# Altium schematic sheet S2C_IOs3V3.SchDoc
size A4; SheetNumber: 12
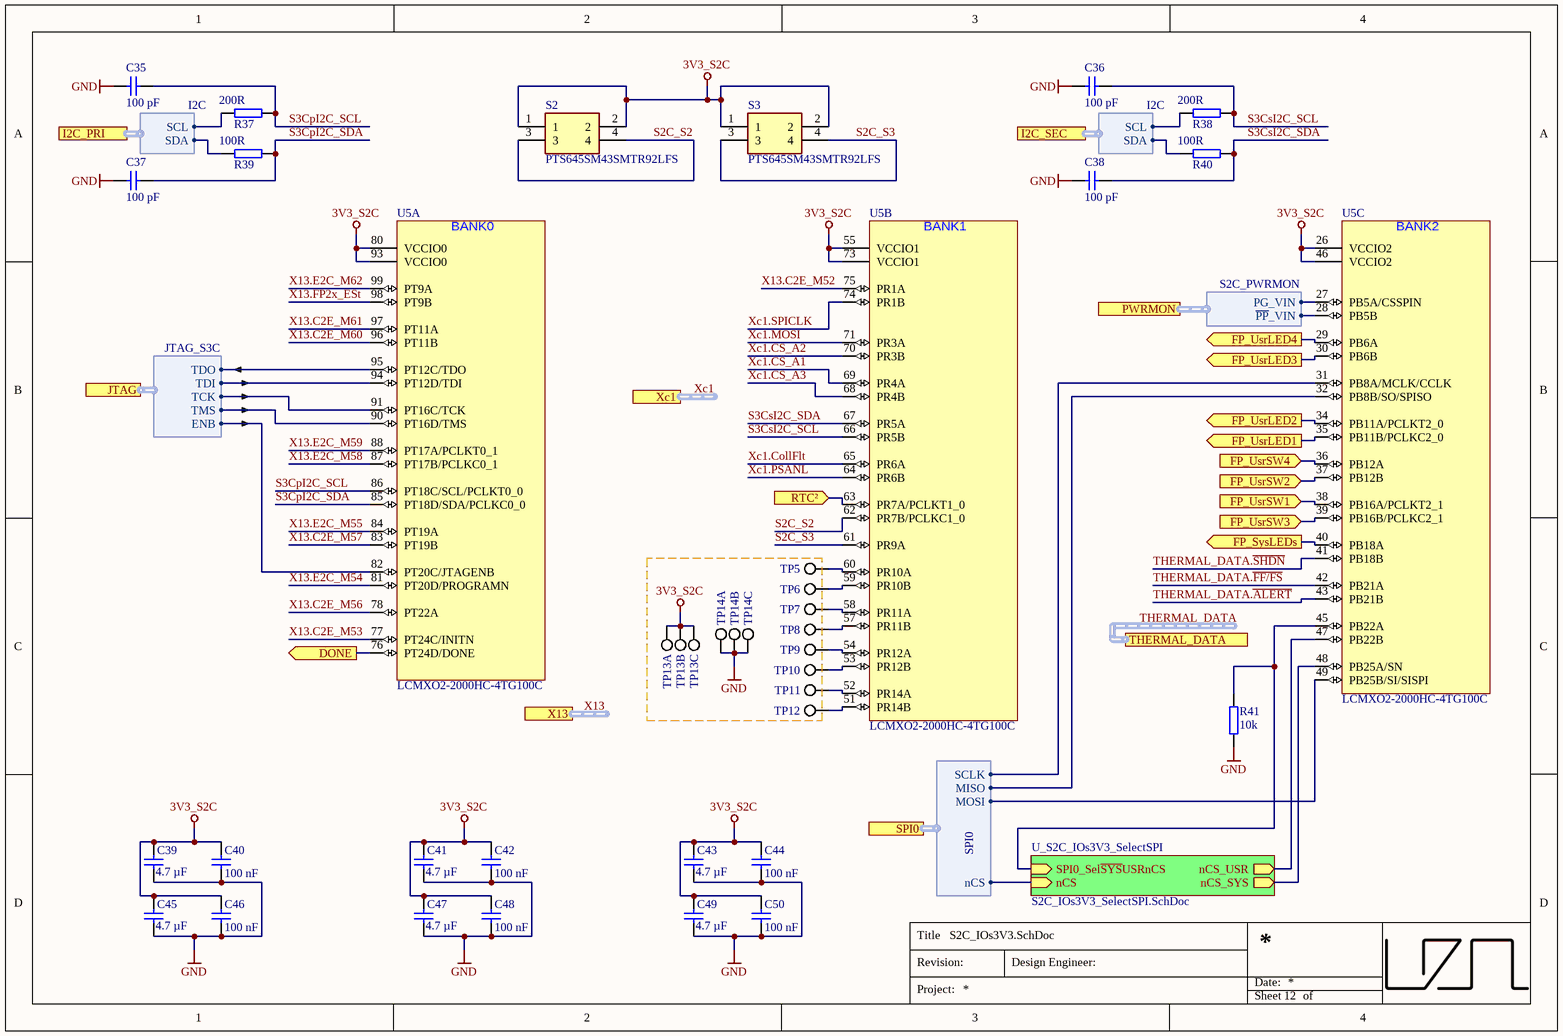
[diagram p0: S2C_IOs3V3.SchDoc]

## Parts
C35  100 pF  [C_0603_TE]
C36  100 pF  [C_0603_TE]
C37  100 pF  [C_0603_TE]
C38  100 pF  [C_0603_TE]
C39  4.7 µF  [C_0603_TE]
C40  100 nF  [C_0603_TE]
C41  4.7 µF  [C_0603_TE]
C42  100 nF  [C_0603_TE]
C43  4.7 µF  [C_0603_TE]
C44  100 nF  [C_0603_TE]
C45  4.7 µF  [C_0603_TE]
C46  100 nF  [C_0603_TE]
C47  4.7 µF  [C_0603_TE]
C48  100 nF  [C_0603_TE]
C49  4.7 µF  [C_0603_TE]
C50  100 nF  [C_0603_TE]
R37  200R  [R_0603_TE]
R38  200R  [R_0603_TE]
R39  100R  [R_0603_TE]
R40  100R  [R_0603_TE]
R41  10k  [R_0603_TE]
S2  PTS645SM43SMTR92LFS  [PTS645_SMT]
S3  PTS645SM43SMTR92LFS  [PTS645_SMT]
TP5  PR10A  [FP-5015-MFG]  (value not drawn)
TP6  PR10B  [FP-5015-MFG]  (value not drawn)
TP7  PR11A  [FP-5015-MFG]  (value not drawn)
TP8  PR11B  [FP-5015-MFG]  (value not drawn)
TP9  PR12A  [FP-5015-MFG]  (value not drawn)
TP10  PR12B  [FP-5015-MFG]  (value not drawn)
TP11  PR14A  [FP-5015-MFG]  (value not drawn)
TP12  PR14B  [FP-5015-MFG]  (value not drawn)
TP13A  3V3_S2C  [FP-5015-MFG]  (value not drawn)
TP13B  3V3_S2C  [FP-5015-MFG]  (value not drawn)
TP13C  3V3_S2C  [FP-5015-MFG]  (value not drawn)
TP14A  GND  [FP-5015-MFG]  (value not drawn)
TP14B  GND  [FP-5015-MFG]  (value not drawn)
TP14C  GND  [FP-5015-MFG]  (value not drawn)
U5  LCMXO2-2000HC-4TG100C  [QFP50P1600X1600X160-100N]  (parts A,B,C of 7)

## Sub-sheets
U_S2C_IOs3V3_SelectSPI = S2C_IOs3V3_SelectSPI.SchDoc: nCS (in), SPI0_Sel~{SYS}USRnCS (in), nCS_USR (out), nCS_SYS (out)

## Ports
DONE (out), FP_SysLEDs (out), FP_UsrLED1 (out), FP_UsrLED2 (out), FP_UsrLED3 (out), FP_UsrLED4 (out), FP_UsrSW1 (in), FP_UsrSW2 (in), FP_UsrSW3 (in), FP_UsrSW4 (in), I2C_PRI (harness I2C), I2C_SEC (harness I2C), JTAG (harness JTAG_S3C), PWRMON (harness S2C_PWRMON), RTC² (in), SPI0 (harness SPI0), THERMAL_DATA (harness T_DATA), X13 (harness X13), Xc1 (harness Xc1)

## Harnesses
JTAG_S3C: TDO, TDI, TCK, TMS, ENB
I2C: SCL, SDA
SPI0: SCLK, MOSI, MISO, nCS
S2C_PWRMON: PG_VIN, ~{PP}_VIN

## Nets
3V3_S2C: C39.1 C40.2 C41.1 C42.2 C43.1 C44.2 C45.1 C46.2 C47.1 C48.2 C49.1 C50.2 S2.1 S2.2 S3.1 S3.2 TP13A.1 TP13B.1 TP13C.1 U5.26(VCCIO2) U5.46(VCCIO2) U5.55(VCCIO1) U5.73(VCCIO1) U5.80(VCCIO0) U5.93(VCCIO0)
GND: C35.2 C36.2 C37.2 C38.2 C39.2 C40.1 C41.2 C42.1 C43.2 C44.1 C45.2 C46.1 C47.2 C48.1 C49.2 C50.1 R41.1 TP14A.1 TP14B.1 TP14C.1
DONE: U5.76(PT24D/DONE) ; port DONE
FP_SysLEDs: U5.40(PB18A) ; port FP_SysLEDs
FP_UsrLED1: U5.35(PB11B/PCLKC2_0) ; port FP_UsrLED1
FP_UsrLED2: U5.34(PB11A/PCLKT2_0) ; port FP_UsrLED2
FP_UsrLED3: U5.30(PB6B) ; port FP_UsrLED3
FP_UsrLED4: U5.29(PB6A) ; port FP_UsrLED4
FP_UsrSW1: U5.38(PB16A/PCLKT2_1) ; port FP_UsrSW1
FP_UsrSW2: U5.37(PB12B) ; port FP_UsrSW2
FP_UsrSW3: U5.39(PB16B/PCLKC2_1) ; port FP_UsrSW3
FP_UsrSW4: U5.36(PB12A) ; port FP_UsrSW4
RTC²: U5.63(PR7A/PCLKT1_0) ; port RTC²
S2C_S2: S2.3 S2.4 U5.62(PR7B/PCLKC1_0)
S2C_S3: S3.3 S3.4 U5.61(PR9A)
S3CpI2C_SCL: C35.1 R37.2 U5.86(PT18C/SCL/PCLKT0_0)
S3CpI2C_SDA: C37.1 R39.2 U5.85(PT18D/SDA/PCLKC0_0)
S3CsI2C_SCL: C36.1 R38.2 U5.66(PR5B)
S3CsI2C_SDA: C38.1 R40.2 U5.67(PR5A)
THERMAL_DATA.~{ALERT}: U5.43(PB21B)
THERMAL_DATA.~{FF/FS}: U5.42(PB21A)
THERMAL_DATA.~{SHDN}: U5.41(PB18B)
X13.C2E_M52: U5.75(PR1A)
X13.C2E_M53: U5.77(PT24C/INITN)
X13.C2E_M56: U5.78(PT22A)
X13.C2E_M57: U5.83(PT19B)
X13.C2E_M60: U5.96(PT11B)
X13.C2E_M61: U5.97(PT11A)
X13.E2C_M54: U5.81(PT20D/PROGRAMN)
X13.E2C_M55: U5.84(PT19A)
X13.E2C_M58: U5.87(PT17B/PCLKC0_1)
X13.E2C_M59: U5.88(PT17A/PCLKT0_1)
X13.E2C_M62: U5.99(PT9A)
X13.FP2x_ESt: U5.98(PT9B)
Xc1.CollFlt: U5.65(PR6A)
Xc1.CS_A1: U5.69(PR4A)
Xc1.CS_A2: U5.70(PR3B)
Xc1.CS_A3: U5.68(PR4B)
Xc1.MOSI: U5.71(PR3A)
Xc1.PSANL: U5.64(PR6B)
Xc1.SPICLK: U5.74(PR1B)
NetR37_1: R37.1 ; port I2C_PRI.SCL
NetR38_1: R38.1 ; port I2C_SEC.SCL
NetR39_1: R39.1 ; port I2C_PRI.SDA
NetR40_1: R40.1 ; port I2C_SEC.SDA
NetR41_2: R41.2 U5.45(PB22A) ; sheet U_S2C_IOs3V3_SelectSPI/SPI0_Sel~{SYS}USRnCS
NetTP5_1: TP5.1 U5.60(PR10A)
NetTP6_1: TP6.1 U5.59(PR10B)
NetTP7_1: TP7.1 U5.58(PR11A)
NetTP8_1: TP8.1 U5.57(PR11B)
NetTP9_1: TP9.1 U5.54(PR12A)
NetTP10_1: TP10.1 U5.53(PR12B)
NetTP11_1: TP11.1 U5.52(PR14A)
NetTP12_1: TP12.1 U5.51(PR14B)
NetU5_27: U5.27(PB5A/CSSPIN) ; port PWRMON.PG_VIN
NetU5_28: U5.28(PB5B) ; port PWRMON.~{PP}_VIN
NetU5_31: U5.31(PB8A/MCLK/CCLK) ; port SPI0.SCLK
NetU5_32: U5.32(PB8B/SO/SPISO) ; port SPI0.MISO
NetU5_47: U5.47(PB22B) ; sheet U_S2C_IOs3V3_SelectSPI/nCS_USR
NetU5_48: U5.48(PB25A/SN) ; sheet U_S2C_IOs3V3_SelectSPI/nCS_SYS
NetU5_49: U5.49(PB25B/SI/SISPI) ; port SPI0.MOSI
NetU5_82: U5.82(PT20C/JTAGENB) ; port JTAG.ENB
NetU5_90: U5.90(PT16D/TMS) ; port JTAG.TMS
NetU5_91: U5.91(PT16C/TCK) ; port JTAG.TCK
NetU5_94: U5.94(PT12D/TDI) ; port JTAG.TDI
NetU5_95: U5.95(PT12C/TDO) ; port JTAG.TDO
(unnamed): sheet U_S2C_IOs3V3_SelectSPI/nCS, port SPI0.nCS

## Buses and harness runs
harness THERMAL_DATA = port THERMAL_DATA
harness X13 = port X13
harness Xc1 = port Xc1

## Notes on the sheet
- Title
- Revision:
- Design Engineer:
- Date:
- Project:
- Sheet
- of
- (in symbol LCMXO2-2000HC-4TG100C, part A) BANK0
- (in symbol LCMXO2-2000HC-4TG100C, part B) BANK1
- (in symbol LCMXO2-2000HC-4TG100C, part C) BANK2

## Library data of the parts
C35-C38 = UZgen_C_0603_100pF_50V_X7R: Generic capacitor; Manufacturer: UZgen; Voltage: 50V; Tolerance: 10 %; Created from: UZgenTool; Manufacturer Part Number: UZgen_C_0603_100pF_50V_X7R; PartID: 4215; Created On: 02/08/2024 11:18:08; Value: 100 pF; Device Package: 0603; Technology: X7R; Mounting Type: SMD; Last Updated: 02/08/2024 11:18:08
C39 C41 C43 C45 C47 C49 = UZgen_C_0603_4.7uF_16V_X5R: Generic capacitor; Manufacturer: UZgen; Voltage: 16V; Tolerance: 10 %; Created from: MGeier; Manufacturer Part Number: UZgen_C_0603_4.7uF_16V_X5R; PartID: 5809; Created On: 20/03/2025 14:43:45; Value: 4.7 µF; Device Package: 0603; Technology: X5R; Mounting Type: SMD; Last Updated: 20/03/2025 14:43:45
C40 C42 C44 C46 C48 C50 = UZgen_C_0603_100nF_50V_X7R: Generic capacitor; Manufacturer: UZgen; Tolerance: 10 %; Voltage: 50 V; Created from: AGeiger; Value: 100 nF; Technology: X7R; Manufacturer Part Number: UZgen_C_0603_100nF_50V_X7R; PartID: 1; Created On: 02/07/2024 14:42:23; Device Package: 0603; Mounting Type: SMD; Last Updated: 02/08/2024 14:45:57
R37 R38 = UZgen_R_0603_200R: Generic resistor; Manufacturer: UZgen; Tolerance: 1 %; Created from: UZgenTool; Manufacturer Part Number: UZgen_R_0603_200R; PartID: 204; Created On: 02/07/2024 17:29:49; Value: 200R; Device Package: 0603; Mounting Type: SMD; Last Updated: 02/07/2024 17:29:49
R39 R40 = UZgen_R_0603_100R: Generic resistor; Manufacturer: UZgen; Tolerance: 1 %; Created from: UZgenTool; Manufacturer Part Number: UZgen_R_0603_100R; PartID: 197; Created On: 02/07/2024 17:29:48; Value: 100R; Device Package: 0603; Mounting Type: SMD; Last Updated: 02/07/2024 17:29:48
R41 = UZgen_R_0603_10k: Generic resistor; Manufacturer: UZgen; Tolerance: 1 %; Created from: AGeiger; Manufacturer Part Number: UZgen_R_0603_10k; PartID: 1; Created On: 02/07/2024 14:34:53; Value: 10k; Device Package: 0603; Mounting Type: SMD; Last Updated: 02/07/2024 14:37:16
S2 S3 = PTS645SM43SMTR92LFS: 50mA SPST 160gf 12V SMD-4P,6x6mm Tactile Switches ROHS; Manufacturer_Name: C & K COMPONENTS; Manufacturer: C&K COMPONENTS; Value: Push Button; Created from: AGeiger; Datasheet Link: https://www.ckswitches.com/media/1471/pts645.pdf; Manufacturer_Part_Number: PTS645SM43SMTR92LFS; Mouser Part Number: 611-PTS645SM43SMTR92; Mouser Price/Stock: https://www.mouser.co.uk/ProductDetail/CK/PTS645SM43SMTR92LFS?qs=FESYatJ8odKPktxv6ncfWg%3D%3D; Arrow Part Number: PTS645SM43SMTR92LFS; Arrow Price/Stock: https://www.arrow.com/en/products/pts645sm43smtr92lfs/ck; Manufacturer Part Number: PTS645SM43SMTR92LFS; PartID: 24; Created On: 31/05/2023 15:31:02; ComponentLink1Description: Datasheet; ComponentLink1URL: https://datasheet.lcsc.com/lcsc/1810121628_C-K-PTS645SM43SMTR92LFS_C221880.pdf; Component Type: Tactile Switch; Device Package: SMD; Last Updated: 31/05/2023 15:31:02; Mounting Type: SMD; Operating Temperature: -20 to +60 °C; Supplier 1: Mouser; Supplier Part Number 1: 611-PTS645SM43SMTR92; Supplier 2: LCSC; Supplier Part Number 2: C221880; Type: Tactile Switch; Live Cycle Status: 1; LCSC Part Number: C221880
TP5-TP12 TP13A TP13B TP13C TP14A TP14B TP14C = 5015: Circuit Board Hardware - PCB SM TEST POINT ON T&R - MINIATURE; Manufacturer Part Number: 5015; Manufacturer: Keystone Electronics; Created from: AGeiger; ComponentLink1Description: Datasheet; ComponentLink2URL: http://www.keyelco.com/product-pdf.cfm?p=1357; ComponentLink1URL: https://www.mouser.de/datasheet/2/215/015-744075.pdf; ComponentLink2Description: Datasheet; PartID: 26; Created On: 03/06/2023 11:19:55; Component Type: Circuit Board Hardware; Device Package: SMD; Last Updated: 03/06/2023 11:43:17; Mounting Type: SMD; Supplier 1: Mouser; Supplier Part Number 1: 534-5015; Type: PCB SMD Testpoint; Live Cycle Status: 1; LCSC Part Number: C5199798
  TP5: Value: PR10A
  TP6: Value: PR10B
  TP7: Value: PR11A
  TP8: Value: PR11B
  TP9: Value: PR12A
  TP10: Value: PR12B
  TP11: Value: PR14A
  TP12: Value: PR14B
  TP13A TP13B TP13C: Value: 3V3_S2C
  TP14A TP14B TP14C: Value: GND
U5 = LCMXO2-2000HC-4TG100C: TQFP-100(14x14) Programmable Logic Device (CPLDs/FPGAs) ROHS; Manufacturer: Lattice; Created from: FRosner; Manufacturer Part Number: LCMXO2-2000HC-4TG100C; PartID: 37; Created On: 03/07/2024 17:33:36; ComponentLink1Description: Datasheet; ComponentLink1URL: https://wmsc.lcsc.com/wmsc/upload/file/pdf/v2/lcsc/2403111456_Lattice-LCMXO2-2000HC-4TG100C_C1521632.pdf; Component Type: CPLD; Device Package: TQFP-100; Last Updated: 23/08/2024 11:42:29; Mounting Type: SMD; Operating Temperature: -0 to +85 °C; Supplier 1: LCSC; Supplier Part Number 1: C1521632; Supplier 2: Mouser; Supplier Part Number 2: 842-XO22000HC4TG100C; Type: CPLD; Live Cycle Status: 1; LCSC Part Number: C1521632; Stock number: not stored